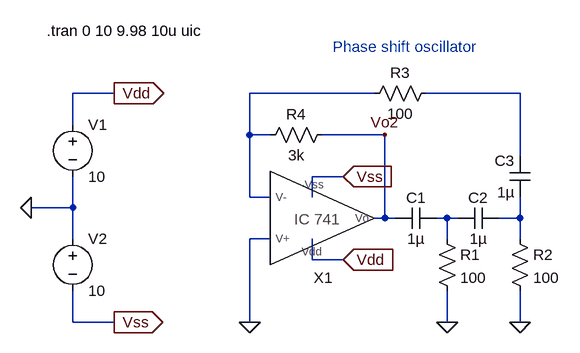
[diagram p0: schematic phase shift oscillator.asc]
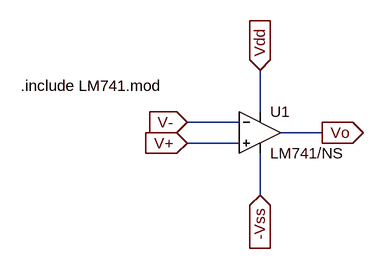
[diagram p1: sub-circuit ic741.asc]
phase shift oscillator.asc, the LTspice schematic file:
Version 4
SHEET 1 880 680
WIRE -272 -16 -336 -16
WIRE 128 -16 -64 -16
WIRE 352 -16 208 -16
WIRE -336 32 -336 -16
WIRE -64 48 -64 -16
WIRE -32 48 -64 48
WIRE 144 48 48 48
WIRE 352 80 352 -16
WIRE 80 112 32 112
WIRE -64 144 -64 48
WIRE -32 144 -64 144
WIRE 32 144 32 112
WIRE -336 160 -336 112
WIRE -336 160 -400 160
WIRE 144 176 144 48
WIRE 144 176 128 176
WIRE 160 176 144 176
WIRE 240 176 224 176
WIRE 256 176 240 176
WIRE 352 176 352 144
WIRE 352 176 320 176
WIRE -336 208 -336 160
WIRE -32 208 -64 208
WIRE 240 208 240 176
WIRE 352 208 352 176
WIRE 32 240 32 208
WIRE 80 240 32 240
WIRE -336 336 -336 288
WIRE -272 336 -336 336
WIRE -64 336 -64 208
WIRE 240 336 240 288
WIRE 352 336 352 288
FLAG 80 112 Vss
IOPIN 80 112 In
FLAG 80 240 Vdd
IOPIN 80 240 In
FLAG -64 336 0
FLAG 240 336 0
FLAG 352 336 0
FLAG 144 48 Vo2
FLAG -400 160 0
FLAG -272 -16 Vdd
IOPIN -272 -16 Out
FLAG -272 336 Vss
IOPIN -272 336 Out
SYMBOL IC741 48 160 M180
SYMATTR InstName X1
SYMBOL cap 224 160 R90
WINDOW 0 0 32 VBottom 2
WINDOW 3 32 32 VTop 2
SYMATTR InstName C1
SYMATTR Value 1µ
SYMBOL cap 320 160 R90
WINDOW 0 0 32 VBottom 2
WINDOW 3 32 32 VTop 2
SYMATTR InstName C2
SYMATTR Value 1µ
SYMBOL cap 368 144 R180
WINDOW 0 24 56 Left 2
WINDOW 3 24 8 Left 2
SYMATTR InstName C3
SYMATTR Value 1µ
SYMBOL res 224 192 R0
SYMATTR InstName R1
SYMATTR Value 100
SYMBOL res 336 192 R0
SYMATTR InstName R2
SYMATTR Value 100
SYMBOL res 224 -32 R90
WINDOW 0 0 56 VBottom 2
WINDOW 3 32 56 VTop 2
SYMATTR InstName R3
SYMATTR Value 100
SYMBOL res 64 32 R90
WINDOW 0 0 56 VBottom 2
WINDOW 3 32 56 VTop 2
SYMATTR InstName R4
SYMATTR Value 3k
SYMBOL voltage -336 16 R0
WINDOW 123 0 0 Left 0
WINDOW 39 0 0 Left 0
SYMATTR InstName V1
SYMATTR Value 10
SYMBOL voltage -336 192 R0
WINDOW 123 0 0 Left 0
WINDOW 39 0 0 Left 0
SYMATTR InstName V2
SYMATTR Value 10
TEXT 64 -88 Left 2 ;Phase shift oscillator
TEXT -376 -112 Left 2 !.tran 0 10 9.98 10u uic

ic741.asc, the sub-circuit schematic file:
Version 4
SHEET 1 880 680
WIRE 368 128 368 64
WIRE 336 144 256 144
WIRE 464 160 400 160
WIRE 336 176 256 176
WIRE 368 256 368 192
FLAG 464 160 Vo
IOPIN 464 160 Out
FLAG 368 64 Vdd
IOPIN 368 64 In
FLAG 368 256 -Vss
IOPIN 368 256 In
FLAG 256 176 V+
IOPIN 256 176 In
FLAG 256 144 V-
IOPIN 256 144 In
SYMBOL OpAmps\\opamp2 368 96 R0
SYMATTR InstName U1
SYMATTR Value LM741/NS
TEXT 0 88 Left 2 !.include LM741.mod

The netlist it stands for:
* phase shift oscillator.asc
XX1 Vss 0 N001 Vdd Vo2 ic741
C1 N003 Vo2 1µ
C2 N004 N003 1µ
C3 N004 N002 1µ
R1 N003 0 100
R2 N004 0 100
R3 N002 N001 100
R4 Vo2 N001 3k
V1 Vdd 0 10
V2 0 Vss 10

* block symbol definitions
.subckt ic741 -Vss V+ V- Vdd Vo
XU1 V+ V- Vdd -Vss Vo LM741/NS  ; pins In+ In- V+ V- OUT
.include LM741.mod
.ends ic741

* Phase shift oscillator
.tran 0 10 9.98 10u uic
.backanno
.end